# Altium project 脉诊.PrjPcb
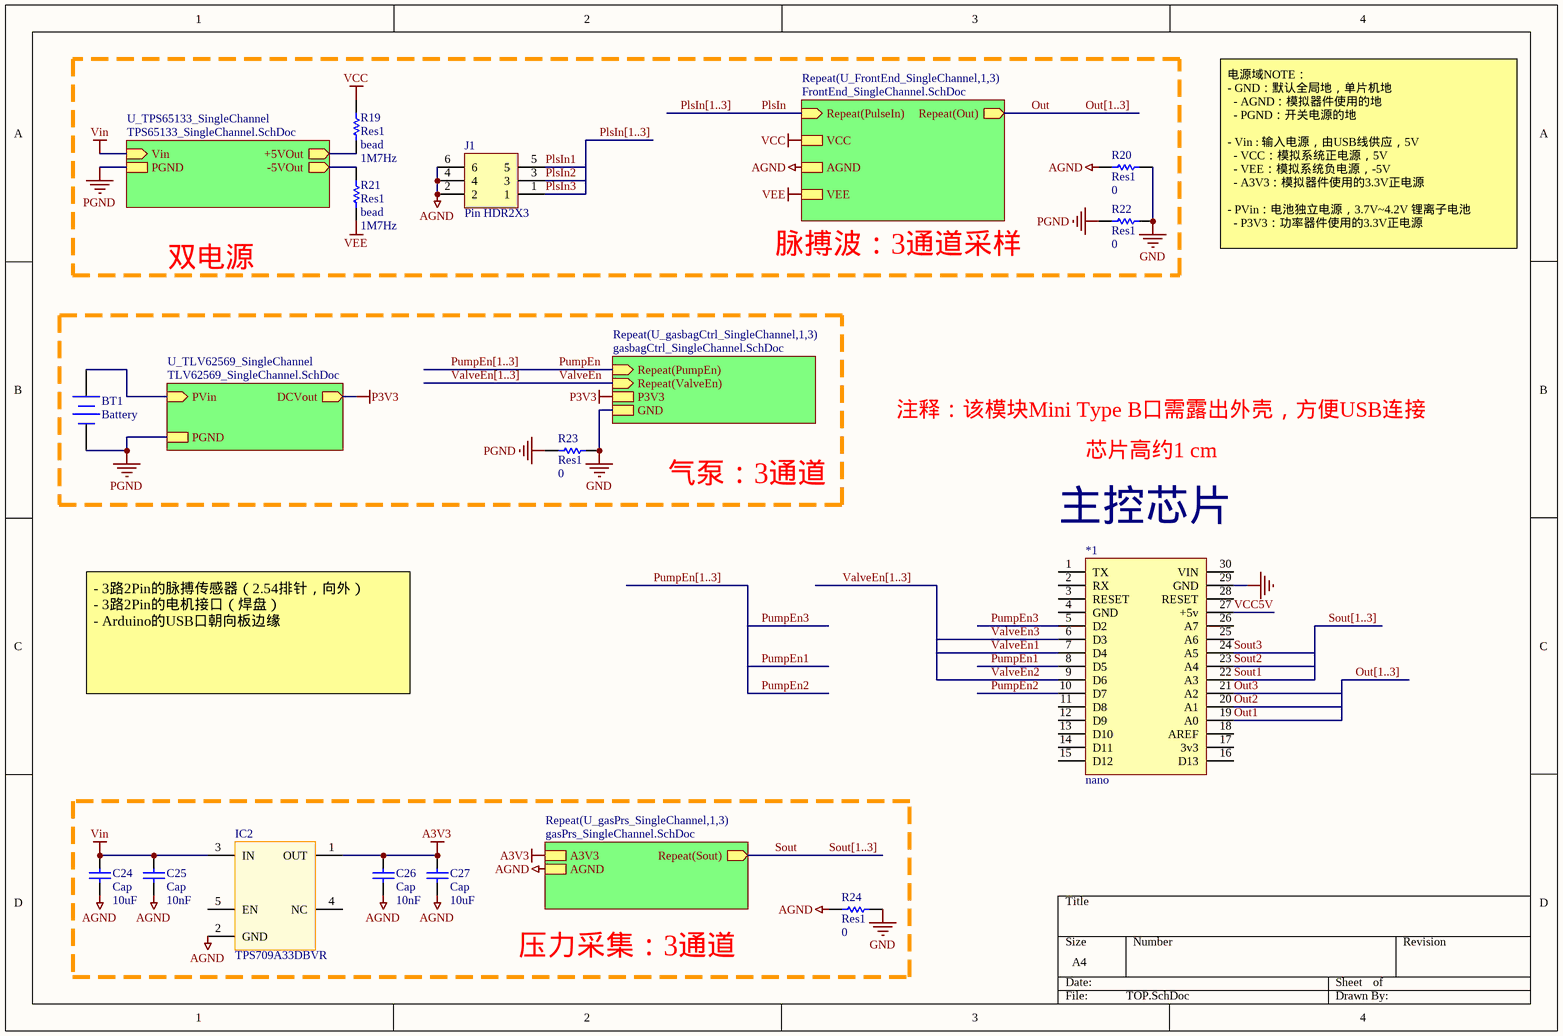
[diagram p0: TOP.SchDoc]
6 sheets, 248 parts. Net scope: hierarchical (ports join the sheet entries above them; power ports are global).
Sheets:
  TOP.SchDoc
    U_FrontEnd_SingleChannel1 = FrontEnd_SingleChannel.SchDoc
    U_FrontEnd_SingleChannel2 = FrontEnd_SingleChannel.SchDoc
    U_FrontEnd_SingleChannel3 = FrontEnd_SingleChannel.SchDoc
    U_gasbagCtrl_SingleChannel1 = gasbagCtrl_SingleChannel.SchDoc
    U_gasbagCtrl_SingleChannel2 = gasbagCtrl_SingleChannel.SchDoc
    U_gasbagCtrl_SingleChannel3 = gasbagCtrl_SingleChannel.SchDoc
    U_gasPrs_SingleChannel1 = gasPrs_SingleChannel.SchDoc
    U_gasPrs_SingleChannel2 = gasPrs_SingleChannel.SchDoc
    U_gasPrs_SingleChannel3 = gasPrs_SingleChannel.SchDoc
    U_TPS65133_SingleChannel = TPS65133_SingleChannel.SchDoc
    U_TLV62569_SingleChannel = TLV62569_SingleChannel.SchDoc

## Sheet TOP.SchDoc
size A4

### Parts
*1  nano  [nano]
BT1  Battery  [BAT-2]
C24  Cap  value 10uF  [0603C]
C25  Cap  value 10nF  [0603C]
C26  Cap  value 10nF  [0603C]
C27  Cap  value 10uF  [0603C]
IC2  TPS709A33DBVR  [SOT95P280X145-5N]
J1  Pin HDR2X3  [Pin HDR2X3/2.54mm-S]
R19  Res1  value bead  Frequency: 1M7Hz  [0603R]
R20  Res1  value 0  [0603R]
R21  Res1  value bead  Frequency: 1M7Hz  [0603R]
R22  Res1  value 0  [0603R]
R23  Res1  value 0  [0603R]
R24  Res1  value 0  [0603R]

### Blocks framed on the sheet
气泵：3通道: BT1 R23
压力采集：3通道: C24-C27 IC2 R24

### Sub-sheets
Repeat(U_FrontEnd_SingleChannel,1,3) = FrontEnd_SingleChannel.SchDoc: Repeat(PulseIn) (in), AGND, Repeat(Out) (out), VCC, VEE
Repeat(U_gasbagCtrl_SingleChannel,1,3) = gasbagCtrl_SingleChannel.SchDoc: Repeat(PumpEn) (in), Repeat(ValveEn) (in), P3V3, GND
Repeat(U_gasPrs_SingleChannel,1,3) = gasPrs_SingleChannel.SchDoc: Repeat(Sout) (out), A3V3, AGND
U_TLV62569_SingleChannel = TLV62569_SingleChannel.SchDoc: PVin (in), DCVout (out), PGND
U_TPS65133_SingleChannel = TPS65133_SingleChannel.SchDoc: Vin (in), +5VOut (out), -5VOut (out), PGND

### Nets
A3V3: C26.2 C27.2 IC2.1(OUT) ; sheet Repeat(U_gasPrs_SingleChannel,1,3)/A3V3
AGND: C24.1 C25.1 C26.1 C27.1 IC2.2(GND) J1.2 J1.4 J1.6 R20.1 R24.1 ; sheet Repeat(U_FrontEnd_SingleChannel,1,3)/AGND, sheet Repeat(U_gasPrs_SingleChannel,1,3)/AGND
GND: *1.29(GND) R20.2 R22.2 R23.2 R24.2 ; sheet Repeat(U_gasbagCtrl_SingleChannel,1,3)/GND
P3V3: sheet Repeat(U_gasbagCtrl_SingleChannel,1,3)/P3V3, sheet U_TLV62569_SingleChannel/DCVout
PGND: BT1.2(-) R22.1 R23.1 ; sheet U_TPS65133_SingleChannel/PGND, sheet U_TLV62569_SingleChannel/PGND
VCC: R19.2 ; sheet Repeat(U_FrontEnd_SingleChannel,1,3)/VCC
VEE: R21.1 ; sheet Repeat(U_FrontEnd_SingleChannel,1,3)/VEE
Vin: C24.2 C25.2 IC2.3(IN) ; sheet U_TPS65133_SingleChannel/Vin
Out: sheet Repeat(U_FrontEnd_SingleChannel,1,3)/Repeat(Out)
Out1: *1.19(A0)
Out2: *1.20(A1)
Out3: *1.21(A2)
PlsIn: sheet Repeat(U_FrontEnd_SingleChannel,1,3)/Repeat(PulseIn)
PlsIn1: J1.5
PlsIn2: J1.3
PlsIn3: J1.1
PumpEn: sheet Repeat(U_gasbagCtrl_SingleChannel,1,3)/Repeat(PumpEn)
PumpEn1: *1.8(D5)
PumpEn2: *1.10(D7)
PumpEn3: *1.5(D2)
Sout: sheet Repeat(U_gasPrs_SingleChannel,1,3)/Repeat(Sout)
Sout1: *1.22(A3)
Sout2: *1.23(A4)
Sout3: *1.24(A5)
ValveEn: sheet Repeat(U_gasbagCtrl_SingleChannel,1,3)/Repeat(ValveEn)
ValveEn1: *1.7(D4)
ValveEn2: *1.9(D6)
ValveEn3: *1.6(D3)
VCC5V: *1.27(+5v)
NetBT1_1: BT1.1(+) ; sheet U_TLV62569_SingleChannel/PVin
NetC31_2: R19.1 ; sheet U_TPS65133_SingleChannel/+5VOut
NetC35_2: R21.2 ; sheet U_TPS65133_SingleChannel/-5VOut

Not connected (* = marked no-connect by the designer): *1 1(TX) 2(RX) 3(RESET) 4(GND) 11(D8) 12(D9) 13(D10) 14(D11) 15(D12) 16(D13) 17(3v3) 18(AREF) 25(A6) 26(A7) 28(RESET) 30(VIN); IC2 4(NC) 5(EN)

### Buses and harness runs
bus Out[1..3]
bus PlsIn[1..3]
bus PumpEn[1..3]
bus Sout[1..3]
bus ValveEn[1..3]

### Notes on the sheet
- 电源域NOTE：
  - GND：默认全局地，单片机地
  - AGND：模拟器件使用的地
  - PGND：开关电源的地
  - Vin : 输入电源，由USB线供应，5V
  - VCC：模拟系统正电源，5V
  - VEE：模拟系统负电源，-5V
  - A3V3：模拟器件使用的3.3V正电源
  - PVin：电池独立电源，3.7V~4.2V 锂离子电池
  - P3V3：功率器件使用的3.3V正电源
- 双电源
- 脉搏波：3通道采样
- 注释：该模块Mini Type B口需露出外壳，方便USB连接
- 芯片高约1 cm
- (near *1) 主控芯片
- - 3路2Pin的脉搏传感器（2.54排针，向外）
  - 3路2Pin的电机接口（焊盘）
  - Arduino的USB口朝向板边缘

### Library data of the parts
BT1 = Battery: Multicell Battery; Published: 24-Mar-1999; LatestRevisionDate: 17-Jul-2002; LatestRevisionNote: Re-released for DXP Platform.; PackageReference: BAT-2; Publisher: Altium Limited; PackageDescription: Battery; 2 Leads
C24-C27 = Cap: Capacitor; Published: 8-Jun-2000; LatestRevisionDate: 17-Jul-2002; LatestRevisionNote: Re-released for DXP Platform.; PackageReference: RAD-0.3; Publisher: Altium Limited; PackageDescription: Radial Cap, Thru-Hole; 2 Leads; 0.3 in Pin Spacing
IC2 = TPS709A33DBVR: 3.3V 高CMRR LDO; Manufacturer_Name: Texas Instruments; Datasheet Link: http://www.ti.com/lit/gpn/tps709; Height: 1.45mm; Manufacturer_Part_Number: TPS709A33DBVR; Mouser Part Number: 595-TPS709A33DBVR; Mouser Price/Stock: https://www.mouser.co.uk/ProductDetail/Texas-Instruments/TPS709A33DBVR?qs=8%2FmU9qzJpL8xC3krkiti2Q%3D%3D; Arrow Part Number: TPS709A33DBVR; Arrow Price/Stock: https://www.arrow.com/en/products/tps709a33dbvr/texas-instruments?region=nac
R19-R24 = Res1: Resistor; Published: 8-Jun-2000; LatestRevisionDate: 17-Jul-2002; LatestRevisionNote: Re-released for DXP Platform.; PackageReference: AXIAL-0.3; Publisher: Altium Limited; PackageDescription: Axial Device, Thru-Hole; 2 Leads; 0.3 in Pin Spacing

## Sheet FrontEnd_SingleChannel.SchDoc
size 508 x 165 mm
Used 3 times, as channels U_FrontEnd_SingleChannel1, U_FrontEnd_SingleChannel2, U_FrontEnd_SingleChannel3. Parts and nets are listed once, with the designators drawn on the sheet.
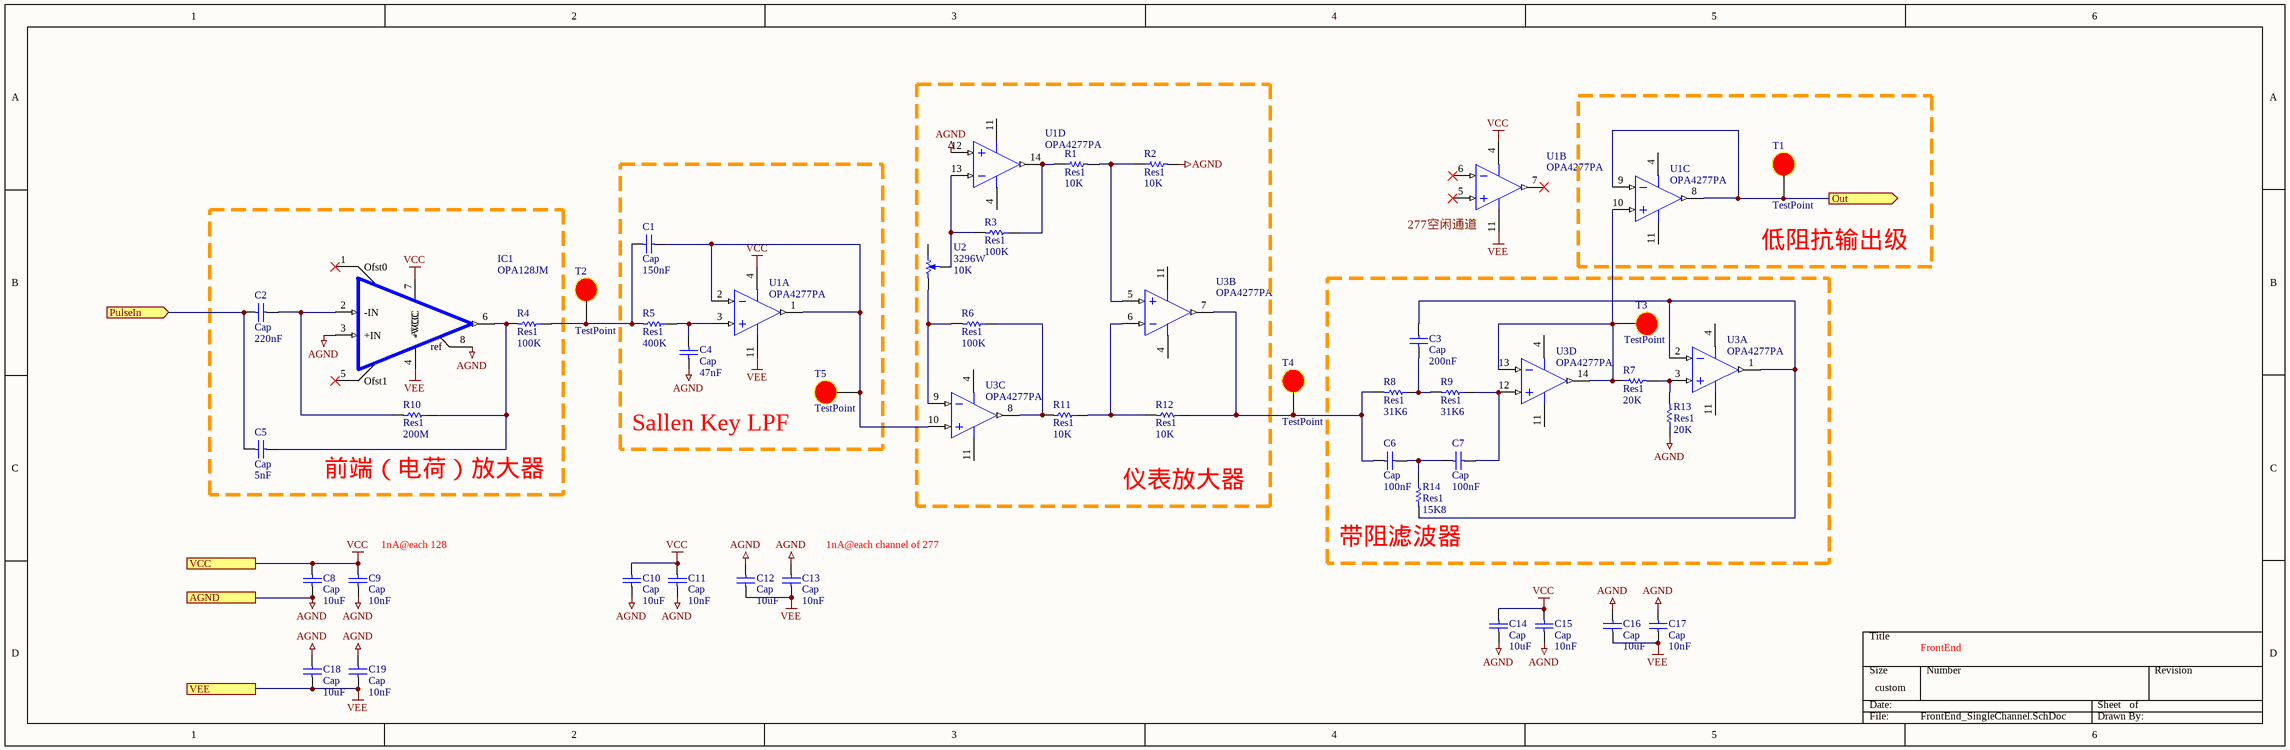
[diagram p1: FrontEnd_SingleChannel.SchDoc]

### Parts
C1  Cap  value 150nF  [0603C]
C2  Cap  value 220nF  [0603C]
C3  Cap  value 200nF  [0603C]
C4  Cap  value 47nF  [0603C]
C5  Cap  value 5nF  [0603C]
C6  Cap  value 100nF  [0603C]
C7  Cap  value 100nF  [0603C]
C8  Cap  value 10uF  [0603C]
C9  Cap  value 10nF  [0603C]
C10  Cap  value 10uF  [0603C]
C11  Cap  value 10nF  [0603C]
C12  Cap  value 10uF  [0603C]
C13  Cap  value 10nF  [0603C]
C14  Cap  value 10uF  [0603C]
C15  Cap  value 10nF  [0603C]
C16  Cap  value 10uF  [0603C]
C17  Cap  value 10nF  [0603C]
C18  Cap  value 10uF  [0603C]
C19  Cap  value 10nF  [0603C]
IC1  OPA128JM  [OPT301M]
R1  Res1  value 10K  [0603R]
R2  Res1  value 10K  [0603R]
R3  Res1  value 100K  [0603R]
R4  Res1  value 100K  [0603R]
R5  Res1  value 400K  [0603R]
R6  Res1  value 100K  [0603R]
R7  Res1  value 20K  [0603R]
R8  Res1  value 31K6  [0603R]
R9  Res1  value 31K6  [0603R]
R10  Res1  value 200M  [0603R]
R11  Res1  value 10K  [0603R]
R12  Res1  value 10K  [0603R]
R13  Res1  value 20K  [0603R]
R14  Res1  value 15K8  [0603R]
T1  TestPoint  [TP_D1mm]
T2  TestPoint  [TP_D1mm]
T3  TestPoint  [TP_D1mm]
T4  TestPoint  [TP_D1mm]
T5  TestPoint  [TP_D1mm]
U1  OPA4277PA  [TI-N14]  (parts A,B,C,D of 4)
U2  3296W  FullValue: 10K  [POT4MM-2]
U3  OPA4277PA  [TI-N14]  (parts A,B,C,D of 4)

### Blocks framed on the sheet
仪表放大器: R1-R3 R6 R11 R12 U1-U3
低阻抗输出级: T1 U1
Sallen Key LPF: C1 C4 R5 T5 U1
前端（电荷）放大器: C2 C5 IC1 R4 R10
带阻滤波器: C3 C6 C7 R7-R9 R13 R14 T3 U3

### Ports
AGND, Out (out), PulseIn (in), VCC, VEE

### Nets
AGND: C4.1 C8.1 C9.1 C10.1 C11.1 C12.1 C13.1 C14.1 C15.1 C16.1 C17.1 C18.1 C19.1 IC1.3(+IN) IC1.8(ref) R2.2 R13.1 U1.12(IN_D+) ; port AGND
VCC: C8.2 C9.2 C10.2 C11.2 C14.2 C15.2 IC1.7(+VCC) U1.4(V+) ; port VCC
VEE: C12.2 C13.2 C16.2 C17.2 C18.2 C19.2 IC1.4(-VCC) U1.11(V-) ; port VEE
Out: T1.9 U1.8(OUT_C) U1.9(IN_C-) ; port Out
PulseIn: C2.1 C5.1 ; port PulseIn
NetC1_1: C1.1 R4.1 R5.2 T2.9
NetC1_2: C1.2 T5.9 U1.1(OUT_A) U1.2(IN_A-) U3.10(IN_C+)
NetC2_2: C2.2 IC1.2(-IN) R10.2
NetC3_1: C3.1 R14.2 U3.1(OUT_A) U3.2(IN_A-)
NetC3_2: C3.2 R8.1 R9.2
NetC4_2: C4.2 R5.1 U1.3(IN_A+)
NetC5_2: C5.2 IC1.6(OUT) R4.2 R10.1
NetC6_1: C6.1 R8.2 R12.1 T4.9 U3.7(OUT_B)
NetC6_2: C6.2 C7.1 R14.1
NetC7_2: C7.2 R9.1 U3.12(IN_D+)
NetR1_1: R1.1 R3.1 U1.14(OUT_D)
NetR1_2: R1.2 R2.1 U3.5(IN_B+)
NetR3_2: R3.2 U1.13(IN_D-) U2.W
NetR6_1: R6.1 R11.2 U3.8(OUT_C)
NetR6_2: R6.2 U2.CCW(-) U3.9(IN_C-)
NetR7_1: R7.1 T3.9 U1.10(IN_C+) U3.13(IN_D-) U3.14(OUT_D)
NetR7_2: R7.2 R13.2 U3.3(IN_A+)
NetR11_1: R11.1 R12.2 U3.6(IN_B-)

Not connected (* = marked no-connect by the designer): IC1 1(Ofst0)* 5(Ofst1)*; U1 5(IN_B+)* 6(IN_B-)* 7(OUT_B)*; U2 CW(+); U3 4(V+) 11(V-)

### Channels
U_FrontEnd_SingleChannel1: designators end in _U_FrontEnd_SingleChannel1; ports AGND=AGND Out=Out1 PulseIn=PlsIn1 VCC=VCC VEE=VEE
U_FrontEnd_SingleChannel2: designators end in _U_FrontEnd_SingleChannel2; ports AGND=AGND Out=Out2 PulseIn=PlsIn2 VCC=VCC VEE=VEE
U_FrontEnd_SingleChannel3: designators end in _U_FrontEnd_SingleChannel3; ports AGND=AGND Out=Out3 PulseIn=PlsIn3 VCC=VCC VEE=VEE

### Notes on the sheet
- (near U1) 277空闲通道
- (near C9) 1nA@each 128
- (near C13) 1nA@each channel of 277
- FrontEnd

### Library data of the parts
C1-C19 = Cap: Capacitor; Published: 8-Jun-2000; LatestRevisionDate: 17-Jul-2002; LatestRevisionNote: Re-released for DXP Platform.; PackageReference: RAD-0.3; Publisher: Altium Limited; PackageDescription: Radial Cap, Thru-Hole; 2 Leads; 0.3 in Pin Spacing
IC1 = OPA128JM: 电荷放大器; Manufacturer_Name: Texas Instruments; Manufacturer_Part_Number: OPA128LM; Datasheet Link: https://datasheet.datasheetarchive.com/originals/distributors/SFDatasheet-6/sf-000127796.pdf; Height: 4.19mm; Mouser Part Number: 595-OPA128LM; Mouser Price/Stock: https://www.mouser.co.uk/ProductDetail/Texas-Instruments/OPA128LM?qs=xRTSnXjzBs4s%252BlGO49ONcw%3D%3D; Arrow Part Number: OPA128LM; Arrow Price/Stock: https://www.arrow.com/en/products/opa128lm/texas-instruments
R1-R14 = Res1: Resistor; Published: 8-Jun-2000; LatestRevisionDate: 17-Jul-2002; LatestRevisionNote: Re-released for DXP Platform.; PackageReference: AXIAL-0.3; Publisher: Altium Limited; PackageDescription: Axial Device, Thru-Hole; 2 Leads; 0.3 in Pin Spacing
T1-T5 = TP: 测试点
U1 U3 = OPA4277PA: High Precision Operational Amplifier, 4 to 36 V, -40 to 85 degC, 14-pin DIP (N14), Green (RoHS & no Sb/Br); Manufacturer: Texas Instruments; CMRR(Min)(dB): 115; GBW(Typ)(MHz): 1; IIB(Max)(pA): 2800; Iq per channel(Max)(mA): 0.825; Number of Channels: 4; Offset Drift(Typ)(uV/C): 0.15; Packing: TUBE; Rating: Catalog; Slew Rate(Typ)(V/us): 0.8; Sub Family: High Supply Voltage Amplifier (>=30V), Low Noise Amp (<=10nV/rtHz), Low Offset Voltage Amplifier (<=500uV), Precision Amplifier; Total Supply Voltage(Max)(+5V is 5, +/-5V is 10): 36; Vio (25C)(Max)(mV): 0.05; DatasheetVersion: SBOS079A; PackageVersion: 4040049/E, 12/2002; PackageReference: N14; PackageDescription: 14-Pin Plastic In-Line, Body 19.305 x 6.35 mm, Pitch 2.54 mm; Supplier 1: Digi-Key; Supplier Part Number 1: OPA4277PA-ND; Supplier 2: Farnell; Supplier Part Number 2: 1097452; Supplier 3: Newark; Supplier Part Number 3: 15M1931; Supplier 4: Mouser; Supplier Part Number 4: 595-OPA4277PA; Eco-Plan: Green (RoHS & no Sb/Br); Total Supply Voltage(Min)(+5V is 5, +/-5V is 10): 4; Mounting Technology: Through Hole; Code_JEDEC: MS-001; PartNumber: OPA4277PA; ComponentLink1Description: Manufacturer URL; ComponentLink1URL: http://www.ti.com/; ComponentLink2Description: Datasheet; ComponentLink2URL: http://www.ti.com/lit/ds/symlink/opa4277.pdf; ComponentLink3Description: Package Specification; ComponentLink3URL: http://www.ti.com/lit/ml/mpdi002c/mpdi002c.pdf
U2 = RPot SM: Square Trimming Potentiometer; Published: 17-Dec-2003; DatasheetDocument: Oct-2003; PackageReference: POT4MM-2; Publisher: Altium Limited; ComponentLink1Description: Manufacturer Link; ComponentLink1URL: http://bourns.com/2/search.html

## Sheet gasbagCtrl_SingleChannel.SchDoc
size A4
Used 3 times, as channels U_gasbagCtrl_SingleChannel1, U_gasbagCtrl_SingleChannel2, U_gasbagCtrl_SingleChannel3. Parts and nets are listed once, with the designators drawn on the sheet.
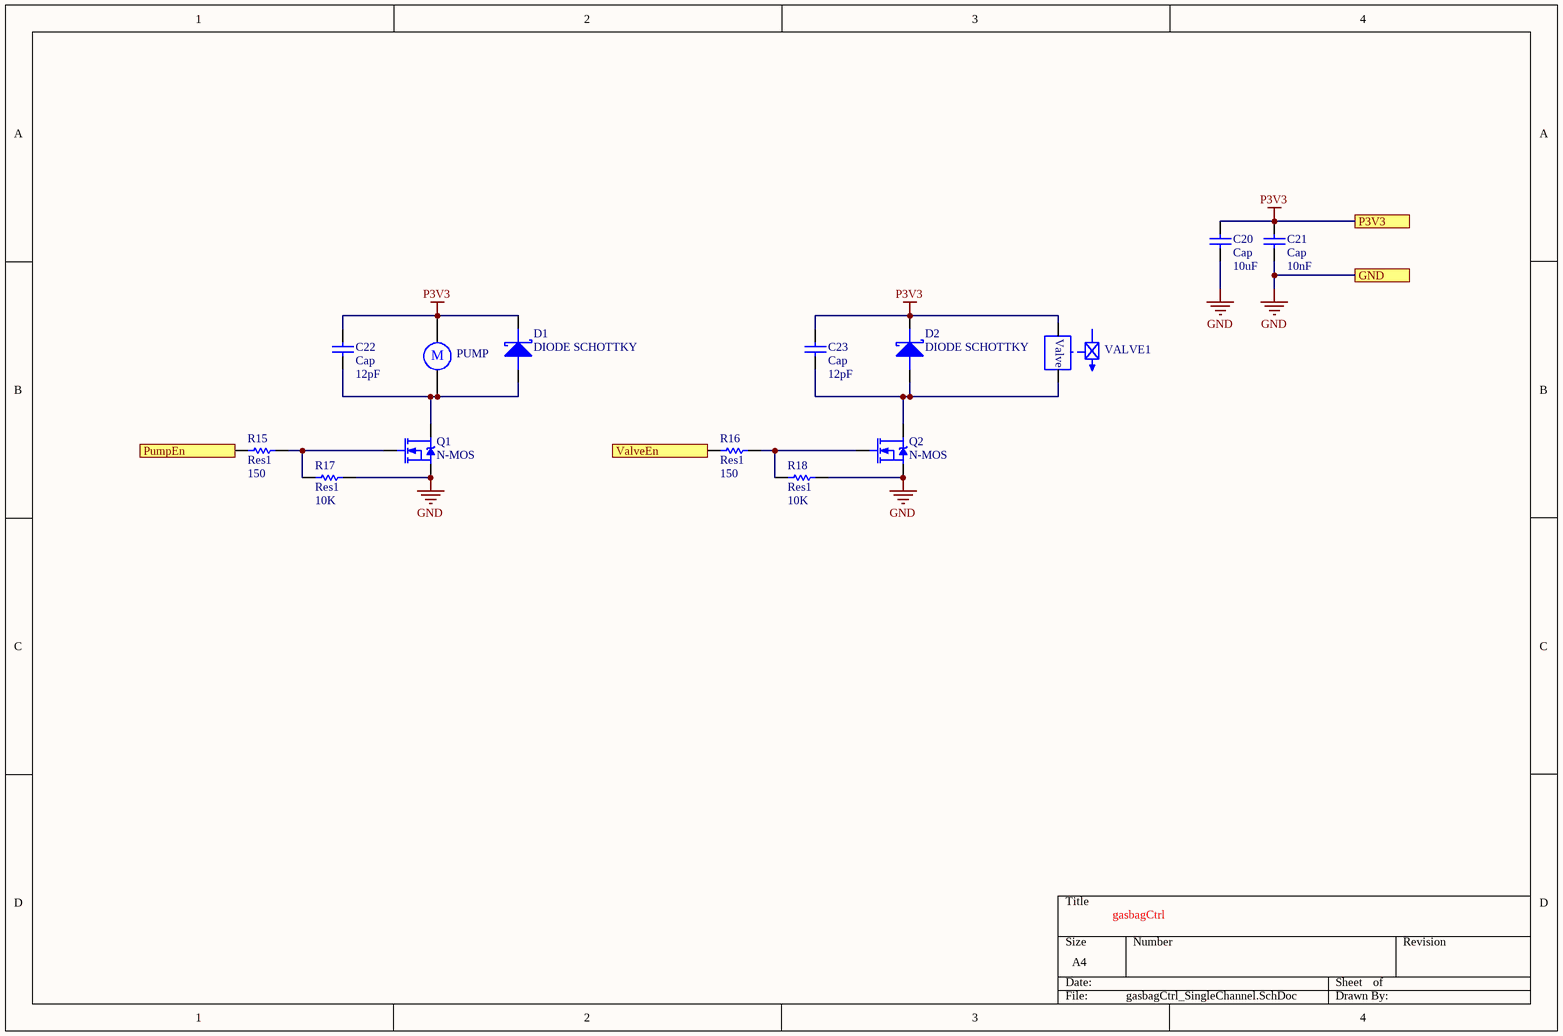
[diagram p2: gasbagCtrl_SingleChannel.SchDoc]

### Parts
B1  PUMP  [BAT-2]
C20  Cap  value 10uF  [0603C]
C21  Cap  value 10nF  [0603C]
C22  Cap  value 12pF  [0603C]
C23  Cap  value 12pF  [0603C]
D1  DIODE SCHOTTKY  [DO-15]
D2  DIODE SCHOTTKY  [DO-15]
Q1  N-MOS  [TO220A]
Q2  N-MOS  [TO220A]
R15  Res1  value 150  [0603R]
R16  Res1  value 150  [0603R]
R17  Res1  value 10K  [0603R]
R18  Res1  value 10K  [0603R]
VALVE1  Valve_1  [jack2.54]  (value not drawn)

### Ports
GND, P3V3, PumpEn (in), ValveEn (in)

### Nets
GND: C20.1 C21.1 Q1.S Q2.S R17.1 R18.1 ; port GND
P3V3: B1.1 C20.2 C21.2 C22.2 C23.2 D1.K D2.K VALVE1.2 ; port P3V3
PumpEn: R15.2 ; port PumpEn
ValveEn: R16.2 ; port ValveEn
NetB1_2: B1.2 C22.1 D1.A Q1.D
NetC23_1: C23.1 D2.A Q2.D VALVE1.1
NetQ1_G: Q1.G R15.1 R17.2
NetQ2_G: Q2.G R16.1 R18.2

### Channels
U_gasbagCtrl_SingleChannel1: designators end in _U_gasbagCtrl_SingleChannel1; ports GND=GND P3V3=P3V3 PumpEn=PumpEn1 ValveEn=ValveEn1
U_gasbagCtrl_SingleChannel2: designators end in _U_gasbagCtrl_SingleChannel2; ports GND=GND P3V3=P3V3 PumpEn=PumpEn2 ValveEn=ValveEn2
U_gasbagCtrl_SingleChannel3: designators end in _U_gasbagCtrl_SingleChannel3; ports GND=GND P3V3=P3V3 PumpEn=PumpEn3 ValveEn=ValveEn3

### Notes on the sheet
- gasbagCtrl
- (in symbol Motor) M
- (in symbol Valve_1) Valve

### Library data of the parts
B1 = Motor: Motor, General Kind; Published: 24-Mar-1999; LatestRevisionDate: 17-Jul-2002; LatestRevisionNote: Re-released for DXP Platform.; PackageReference: RB5-10.5; Publisher: Altium Limited
C20-C23 = Cap: Capacitor; Published: 8-Jun-2000; LatestRevisionDate: 17-Jul-2002; LatestRevisionNote: Re-released for DXP Platform.; PackageReference: RAD-0.3; Publisher: Altium Limited; PackageDescription: Radial Cap, Thru-Hole; 2 Leads; 0.3 in Pin Spacing
D1 D2 = DIODE SCHOTTKY: 肖特基二极管
Q1 Q2 = N-MOS: N沟道场效应管
R15-R18 = Res1: Resistor; Published: 8-Jun-2000; LatestRevisionDate: 17-Jul-2002; LatestRevisionNote: Re-released for DXP Platform.; PackageReference: AXIAL-0.3; Publisher: Altium Limited; PackageDescription: Axial Device, Thru-Hole; 2 Leads; 0.3 in Pin Spacing

## Sheet gasPrs_SingleChannel.SchDoc
size A4
Used 3 times, as channels U_gasPrs_SingleChannel1, U_gasPrs_SingleChannel2, U_gasPrs_SingleChannel3. Parts and nets are listed once, with the designators drawn on the sheet.
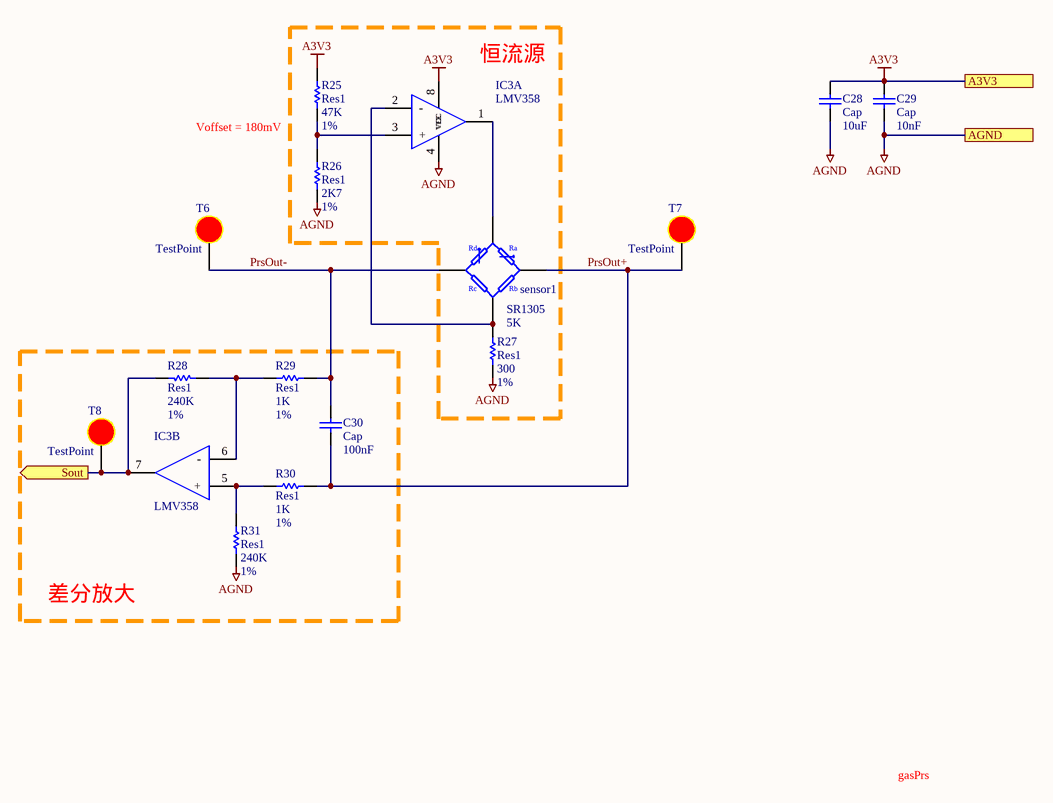
[diagram p3: gasPrs_SingleChannel.SchDoc]

### Parts
C28  Cap  value 10uF  [0603C]
C29  Cap  value 10nF  [0603C]
C30  Cap  value 100nF  [0603C]
IC3  LMV358  [SOIC127P600X175-8N]  (parts A,B of 2)
R25  Res1  value 47K  Delta: 1%  [0603R]
R26  Res1  value 2K7  Delta: 1%  [0603R]
R27  Res1  value 300  Delta: 1%  [0603R]
R28  Res1  value 240K  Delta: 1%  [0603R]
R29  Res1  value 1K  Delta: 1%  [0603R]
R30  Res1  value 1K  Delta: 1%  [0603R]
R31  Res1  value 240K  Delta: 1%  [0603R]
sensor1  SR1305  value 5K  [SENSON]
T6  TestPoint  [TP_D1mm]
T7  TestPoint  [TP_D1mm]
T8  TestPoint  [TP_D1mm]

### Blocks framed on the sheet
恒流源: IC3 R25-R27 sensor1
差分放大: C30 IC3 R28-R31 T8

### Ports
A3V3, AGND, Sout (out)

### Nets
A3V3: C28.2 C29.2 IC3.8(VCC) R25.1 ; port A3V3
AGND: C28.1 C29.1 IC3.4(VEE) R26.2 R27.1 R31.1 ; port AGND
PrsOut+: C30.1 R30.1 sensor1.2 T7.9
PrsOut-: C30.2 R29.1 sensor1.4 T6.9
Sout: IC3.7(OUTB) R28.1 T8.9 ; port Sout
NetIC3_1: IC3.1(OUTA) sensor1.1
NetIC3_2: IC3.2(-) R27.2 sensor1.3
NetIC3_3: IC3.3(+) R25.2 R26.1
NetIC3_5: IC3.5(+) R30.2 R31.2
NetIC3_6: IC3.6(-) R28.2 R29.2

### Channels
U_gasPrs_SingleChannel1: designators end in _U_gasPrs_SingleChannel1; ports A3V3=A3V3 AGND=AGND Sout=Sout1
U_gasPrs_SingleChannel2: designators end in _U_gasPrs_SingleChannel2; ports A3V3=A3V3 AGND=AGND Sout=Sout2
U_gasPrs_SingleChannel3: designators end in _U_gasPrs_SingleChannel3; ports A3V3=A3V3 AGND=AGND Sout=Sout3

### Notes on the sheet
- Voffset = 180mV
- gasPrs
- (in symbol Res Bridge) Rd; Ra; Rc; Rb

### Library data of the parts
C28-C30 = Cap: Capacitor; Published: 8-Jun-2000; LatestRevisionDate: 17-Jul-2002; LatestRevisionNote: Re-released for DXP Platform.; PackageReference: RAD-0.3; Publisher: Altium Limited; PackageDescription: Radial Cap, Thru-Hole; 2 Leads; 0.3 in Pin Spacing
IC3 = LMV358MX_NOPB: Integrated Circuit; Manufacturer_Name: Texas Instruments; Manufacturer_Part_Number: LMV358MX/NOPB; Datasheet Link: http://www.ti.com/lit/gpn/lmv358-n; Height: 1.75mm; Mouser Part Number: 926-LMV358MX/NOPB; Mouser Price/Stock: https://www.mouser.co.uk/ProductDetail/Texas-Instruments/LMV358MX-NOPB?qs=7lkVKPoqpbaZWqXefrgn%2Fg%3D%3D; Arrow Part Number: LMV358MX/NOPB; Arrow Price/Stock: https://www.arrow.com/en/products/lmv358mxnopb/texas-instruments?region=nac
R25-R31 = Res1: Resistor; Published: 8-Jun-2000; LatestRevisionDate: 17-Jul-2002; LatestRevisionNote: Re-released for DXP Platform.; PackageReference: AXIAL-0.3; Publisher: Altium Limited; PackageDescription: Axial Device, Thru-Hole; 2 Leads; 0.3 in Pin Spacing
sensor1 = Res Bridge: Resistor Bridge; Published: 24-Mar-1999; LatestRevisionDate: 17-Jul-2002; LatestRevisionNote: Re-released for DXP Platform.; PackageReference: P04A; Publisher: Altium Limited
T6-T8 = TP: 测试点

## Sheet TPS65133_SingleChannel.SchDoc
size A4
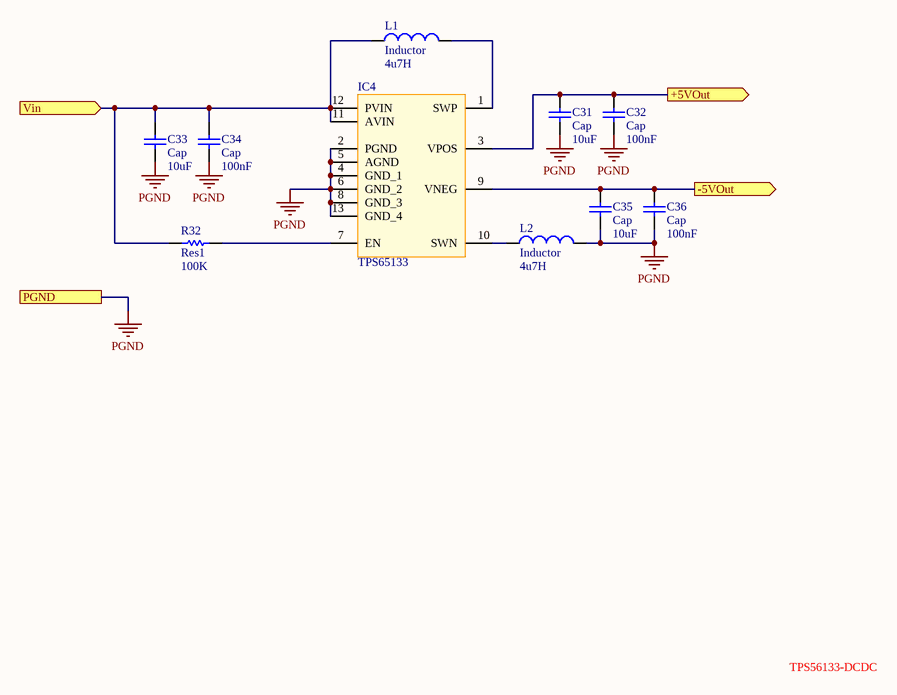
[diagram p4: TPS65133_SingleChannel.SchDoc]

### Parts
C31  Cap  value 10uF  [0603C]
C32  Cap  value 100nF  [0603C]
C33  Cap  value 10uF  [0603C]
C34  Cap  value 100nF  [0603C]
C35  Cap  value 10uF  [0603C]
C36  Cap  value 100nF  [0603C]
IC4  TPS65133  [SON45P300X300X80-13N-D]
L1  Inductor  value 4u7H  [0402-A]
L2  Inductor  value 4u7H  [0402-A]
R32  Res1  value 100K  [0603R]

### Ports
+5VOut (out), -5VOut (out), PGND, Vin (in)

### Nets
PGND: C31.1 C32.1 C33.1 C34.1 C35.1 C36.1 IC4.2(PGND) IC4.4(GND_1) IC4.5(AGND) IC4.6(GND_2) IC4.8(GND_3) IC4.13(GND_4) L2.2 ; port PGND
Vin: C33.2 C34.2 IC4.11(AVIN) IC4.12(PVIN) L1.1 R32.1 ; port Vin
NetC31_2: C31.2 C32.2 IC4.3(VPOS) ; port +5VOut
NetC35_2: C35.2 C36.2 IC4.9(VNEG) ; port -5VOut
NetIC4_1: IC4.1(SWP) L1.2
NetIC4_7: IC4.7(EN) R32.2
NetIC4_10: IC4.10(SWN) L2.1

### Notes on the sheet
- TPS56133-DCDC

### Library data of the parts
C31-C36 = Cap: Capacitor; Published: 8-Jun-2000; LatestRevisionDate: 17-Jul-2002; LatestRevisionNote: Re-released for DXP Platform.; PackageReference: RAD-0.3; Publisher: Altium Limited; PackageDescription: Radial Cap, Thru-Hole; 2 Leads; 0.3 in Pin Spacing
IC4 = TPS65133DPDR: ±5V，250mA 双输出DC-DC电源; Manufacturer_Name: Texas Instruments; Datasheet Link: http://www.ti.com/lit/ds/symlink/tps65133.pdf; Height: 0.8mm; Manufacturer_Part_Number: TPS65133DPDR; Mouser Part Number: 595-TPS65133DPDR; Mouser Price/Stock: https://www.mouser.co.uk/ProductDetail/Texas-Instruments/TPS65133DPDR?qs=7GxONfNUZSjxiorxR5wfmg%3D%3D; Arrow Part Number: TPS65133DPDR; Arrow Price/Stock: https://www.arrow.com/en/products/tps65133dpdr/texas-instruments?region=nac; ComponentLink1Description: TI官网; ComponentLink1URL: https://www.ti.com.cn/cn/lit/ds/symlink/tps65133.pdf?ts=1670145359710&ref_url=https%253A%252F%252Fwww.ti.com.cn%252Fproduct%252Fcn%252FTPS65133
L1 L2 = Inductor: Code_IEC: 1005; Published: 8-Jun-2000; LatestRevisionDate: 29-May-2009; LatestRevisionNote: IPC-7351 Footprint Added.; PackageReference: 0402-A; Publisher: Altium Limited; PackageDescription: Chip Inductor; Code_JEITA: 0402
R32 = Res1: Resistor; Published: 8-Jun-2000; LatestRevisionDate: 17-Jul-2002; LatestRevisionNote: Re-released for DXP Platform.; PackageReference: AXIAL-0.3; Publisher: Altium Limited; PackageDescription: Axial Device, Thru-Hole; 2 Leads; 0.3 in Pin Spacing

## Sheet TLV62569_SingleChannel.SchDoc
size A4
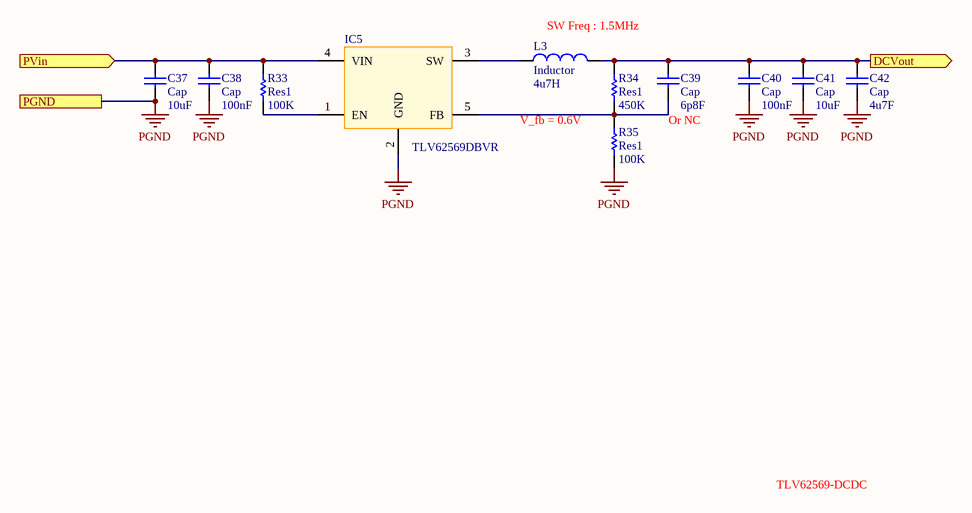
[diagram p5: TLV62569_SingleChannel.SchDoc]

### Parts
C37  Cap  value 10uF  [0603C]
C38  Cap  value 100nF  [0603C]
C39  Cap  value 6p8F  [0603C]
C40  Cap  value 100nF  [0603C]
C41  Cap  value 10uF  [0603C]
C42  Cap  value 4u7F  [0603C]
IC5  TLV62569DBVR  [SOT95P280X145-5N]
L3  Inductor  value 4u7H  [0402-A]
R33  Res1  value 100K  [0603R]
R34  Res1  value 450K  [0603R]
R35  Res1  value 100K  [0603R]

### Ports
DCVout (out), PGND, PVin (in)

### Nets
P3V3: C39.2 C40.2 C41.2 C42.2 L3.2 R34.2 ; port DCVout
PGND: C37.1 C38.1 C40.1 C41.1 C42.1 IC5.2(GND) R35.1 ; port PGND
NetBT1_1: C37.2 C38.2 IC5.4(VIN) R33.2 ; port PVin
NetC39_1: C39.1 IC5.5(FB) R34.1 R35.2
NetIC5_1: IC5.1(EN) R33.1
NetIC5_3: IC5.3(SW) L3.1

### Notes on the sheet
- SW Freq : 1.5MHz
- V_fb = 0.6V
- (near C39) Or NC
- TLV62569-DCDC

### Library data of the parts
C37-C42 = Cap: Capacitor; Published: 8-Jun-2000; LatestRevisionDate: 17-Jul-2002; LatestRevisionNote: Re-released for DXP Platform.; PackageReference: RAD-0.3; Publisher: Altium Limited; PackageDescription: Radial Cap, Thru-Hole; 2 Leads; 0.3 in Pin Spacing
IC5 = TLV62569DBVR: Buck DC-DC; 2.5-V to 5.5-V Input Voltage Range; 95% Efficiency;Output Voltage from 0.6 V to VIN; / SOT-23-5; Manufacturer_Name: Texas Instruments; Datasheet Link: http://www.ti.com/lit/gpn/tlv62569; Height: 1.45mm; Manufacturer_Part_Number: TLV62569DBVR; Mouser Part Number: 595-TLV62569DBVR; Mouser Price/Stock: https://www.mouser.co.uk/ProductDetail/Texas-Instruments/TLV62569DBVR?qs=0C8XhJW8e4oaylc%252BzBrCmA%3D%3D; Arrow Part Number: TLV62569DBVR; Arrow Price/Stock: https://www.arrow.com/en/products/tlv62569dbvr/texas-instruments?region=nac
L3 = Inductor: Code_IEC: 1005; Published: 8-Jun-2000; LatestRevisionDate: 29-May-2009; LatestRevisionNote: IPC-7351 Footprint Added.; PackageReference: 0402-A; Publisher: Altium Limited; PackageDescription: Chip Inductor; Code_JEITA: 0402
R33-R35 = Res1: Resistor; Published: 8-Jun-2000; LatestRevisionDate: 17-Jul-2002; LatestRevisionNote: Re-released for DXP Platform.; PackageReference: AXIAL-0.3; Publisher: Altium Limited; PackageDescription: Axial Device, Thru-Hole; 2 Leads; 0.3 in Pin Spacing

## Nets that join several sheets
A3V3: TOP (C26.2 C27.2 IC2.1), U_gasPrs_SingleChannel1 (C28_U_gasPrs_SingleChannel1.2 C29_U_gasPrs_SingleChannel1.2 IC3_U_gasPrs_SingleChannel1.8 R25_U_gasPrs_SingleChannel1.1), U_gasPrs_SingleChannel2 (C28_U_gasPrs_SingleChannel2.2 C29_U_gasPrs_SingleChannel2.2 IC3_U_gasPrs_SingleChannel2.8 R25_U_gasPrs_SingleChannel2.1), U_gasPrs_SingleChannel3 (C28_U_gasPrs_SingleChannel3.2 C29_U_gasPrs_SingleChannel3.2 IC3_U_gasPrs_SingleChannel3.8 R25_U_gasPrs_SingleChannel3.1)
AGND: TOP (10 pins), U_FrontEnd_SingleChannel1 (18 pins), U_FrontEnd_SingleChannel2 (18 pins), U_FrontEnd_SingleChannel3 (18 pins), U_gasPrs_SingleChannel1 (6 pins), U_gasPrs_SingleChannel2 (6 pins), U_gasPrs_SingleChannel3 (6 pins)
GND: TOP (5 pins), U_gasbagCtrl_SingleChannel1 (6 pins), U_gasbagCtrl_SingleChannel2 (6 pins), U_gasbagCtrl_SingleChannel3 (6 pins)
P3V3: U_gasbagCtrl_SingleChannel1 (8 pins), U_gasbagCtrl_SingleChannel2 (8 pins), U_gasbagCtrl_SingleChannel3 (8 pins), TLV62569_SingleChannel (6 pins)
PGND: TOP (BT1.2 R22.1 R23.1), TPS65133_SingleChannel (13 pins), TLV62569_SingleChannel (7 pins)
VCC: TOP (R19.2), U_FrontEnd_SingleChannel1 (8 pins), U_FrontEnd_SingleChannel2 (8 pins), U_FrontEnd_SingleChannel3 (8 pins)
VEE: TOP (R21.1), U_FrontEnd_SingleChannel1 (8 pins), U_FrontEnd_SingleChannel2 (8 pins), U_FrontEnd_SingleChannel3 (8 pins)
Vin: TOP (C24.2 C25.2 IC2.3), TPS65133_SingleChannel (6 pins)
NetBT1_1: TOP (BT1.1), TLV62569_SingleChannel (C37.2 C38.2 IC5.4 R33.2)
NetC31_2: TOP (R19.1), TPS65133_SingleChannel (C31.2 C32.2 IC4.3)
NetC35_2: TOP (R21.2), TPS65133_SingleChannel (C35.2 C36.2 IC4.9)
Out1: TOP (*1.19), U_FrontEnd_SingleChannel1 (T1_U_FrontEnd_SingleChannel1.9 U1_U_FrontEnd_SingleChannel1.8 U1_U_FrontEnd_SingleChannel1.9)
Out2: TOP (*1.20), U_FrontEnd_SingleChannel2 (T1_U_FrontEnd_SingleChannel2.9 U1_U_FrontEnd_SingleChannel2.8 U1_U_FrontEnd_SingleChannel2.9)
Out3: TOP (*1.21), U_FrontEnd_SingleChannel3 (T1_U_FrontEnd_SingleChannel3.9 U1_U_FrontEnd_SingleChannel3.8 U1_U_FrontEnd_SingleChannel3.9)
PlsIn1: TOP (J1.5), U_FrontEnd_SingleChannel1 (C2_U_FrontEnd_SingleChannel1.1 C5_U_FrontEnd_SingleChannel1.1)
PlsIn2: TOP (J1.3), U_FrontEnd_SingleChannel2 (C2_U_FrontEnd_SingleChannel2.1 C5_U_FrontEnd_SingleChannel2.1)
PlsIn3: TOP (J1.1), U_FrontEnd_SingleChannel3 (C2_U_FrontEnd_SingleChannel3.1 C5_U_FrontEnd_SingleChannel3.1)
PumpEn1: TOP (*1.8), U_gasbagCtrl_SingleChannel1 (R15_U_gasbagCtrl_SingleChannel1.2)
PumpEn2: TOP (*1.10), U_gasbagCtrl_SingleChannel2 (R15_U_gasbagCtrl_SingleChannel2.2)
PumpEn3: TOP (*1.5), U_gasbagCtrl_SingleChannel3 (R15_U_gasbagCtrl_SingleChannel3.2)
Sout1: TOP (*1.22), U_gasPrs_SingleChannel1 (IC3_U_gasPrs_SingleChannel1.7 R28_U_gasPrs_SingleChannel1.1 T8_U_gasPrs_SingleChannel1.9)
Sout2: TOP (*1.23), U_gasPrs_SingleChannel2 (IC3_U_gasPrs_SingleChannel2.7 R28_U_gasPrs_SingleChannel2.1 T8_U_gasPrs_SingleChannel2.9)
Sout3: TOP (*1.24), U_gasPrs_SingleChannel3 (IC3_U_gasPrs_SingleChannel3.7 R28_U_gasPrs_SingleChannel3.1 T8_U_gasPrs_SingleChannel3.9)
ValveEn1: TOP (*1.7), U_gasbagCtrl_SingleChannel1 (R16_U_gasbagCtrl_SingleChannel1.2)
ValveEn2: TOP (*1.9), U_gasbagCtrl_SingleChannel2 (R16_U_gasbagCtrl_SingleChannel2.2)
ValveEn3: TOP (*1.6), U_gasbagCtrl_SingleChannel3 (R16_U_gasbagCtrl_SingleChannel3.2)